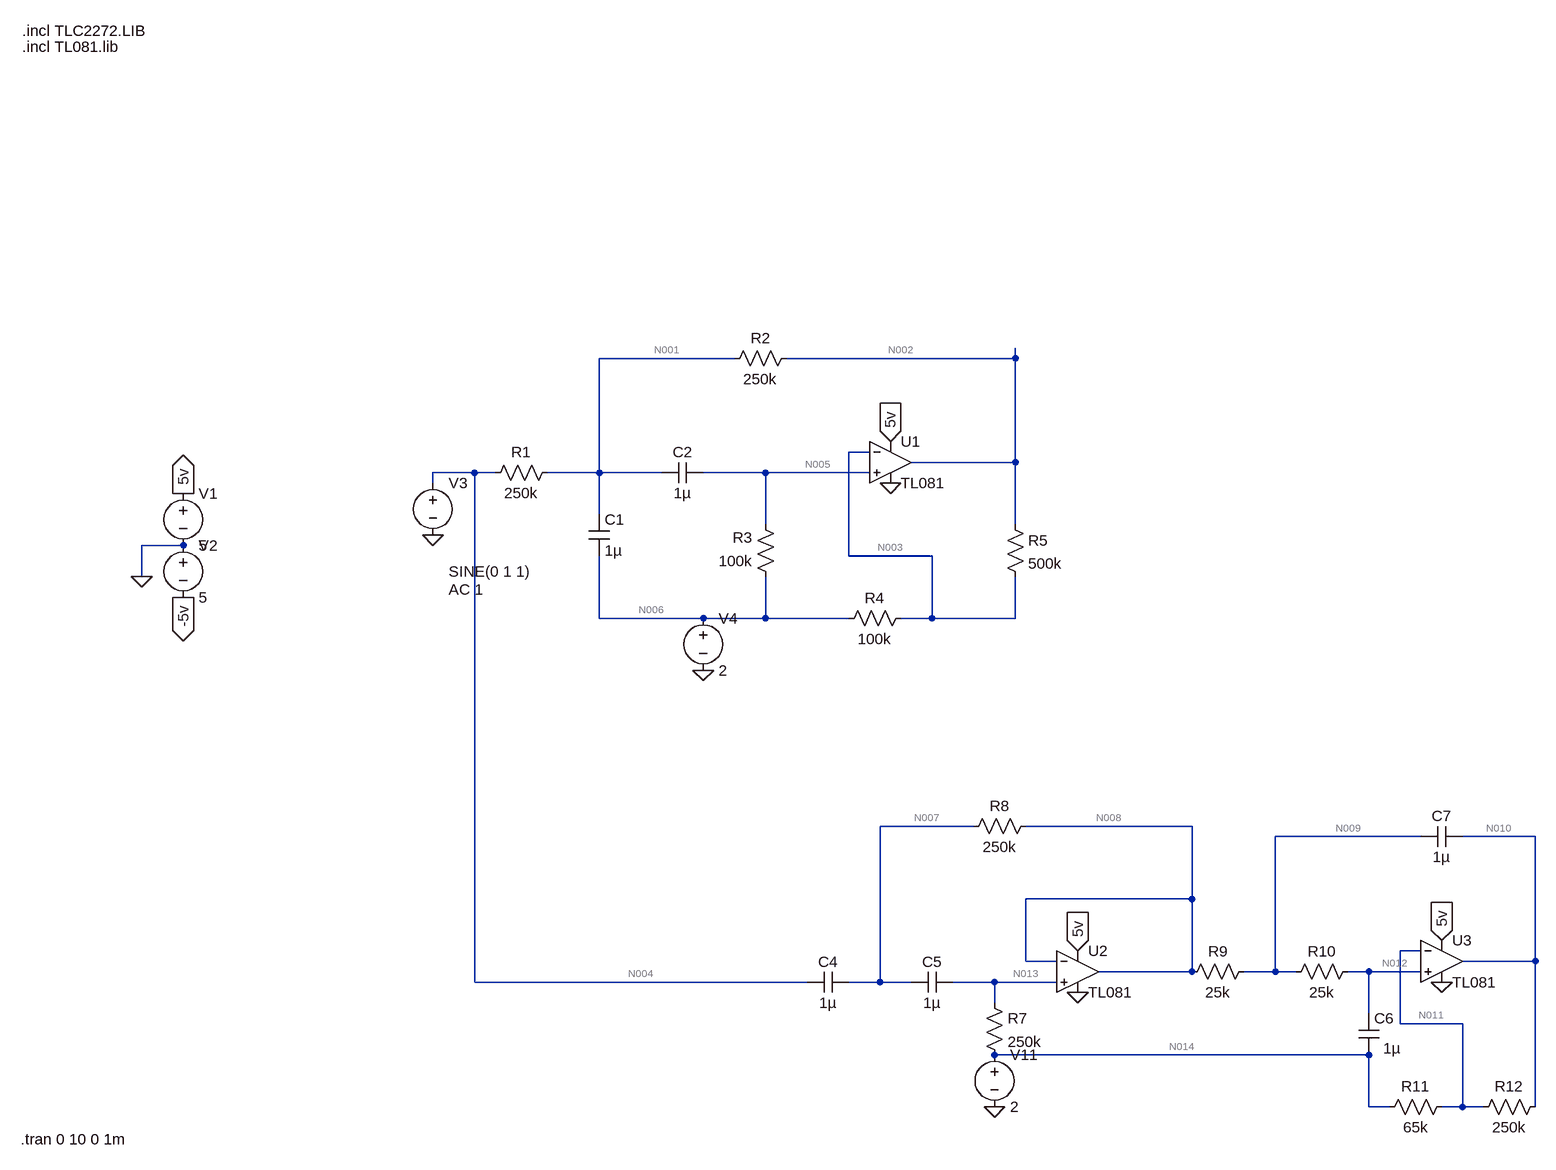
[diagram p0: schematic test2.asc]
test2.asc, the LTspice schematic file:
Version 4
SHEET 1 2552 2084
WIRE 784 -144 576 -144
WIRE 1216 -144 1216 -160
WIRE 1216 -144 864 -144
WIRE 992 0 960 0
WIRE 1216 16 1216 -144
WIRE 1216 16 1056 16
WIRE 384 32 320 32
WIRE 416 32 384 32
WIRE 576 32 576 -144
WIRE 576 32 496 32
WIRE 672 32 576 32
WIRE 832 32 736 32
WIRE 992 32 832 32
WIRE 320 48 320 32
WIRE 576 96 576 32
WIRE 832 112 832 32
WIRE 1216 112 1216 16
WIRE -64 144 -128 144
WIRE 960 160 960 0
WIRE 1088 160 960 160
WIRE -128 192 -128 144
WIRE 576 256 576 160
WIRE 736 256 576 256
WIRE 832 256 832 192
WIRE 832 256 736 256
WIRE 960 256 832 256
WIRE 1088 256 1088 160
WIRE 1088 256 1040 256
WIRE 1216 256 1216 192
WIRE 1216 256 1088 256
WIRE 1152 576 1008 576
WIRE 1488 576 1232 576
WIRE 1840 592 1616 592
WIRE 2016 592 1904 592
WIRE 1488 688 1488 576
WIRE 1488 688 1232 688
WIRE 1840 768 1808 768
WIRE 1232 784 1232 688
WIRE 1280 784 1232 784
WIRE 2016 784 2016 592
WIRE 2016 784 1904 784
WIRE 1488 800 1488 688
WIRE 1488 800 1344 800
WIRE 1616 800 1616 592
WIRE 1616 800 1568 800
WIRE 1648 800 1616 800
WIRE 1760 800 1728 800
WIRE 1840 800 1760 800
WIRE 384 816 384 32
WIRE 896 816 384 816
WIRE 1008 816 1008 576
WIRE 1008 816 960 816
WIRE 1056 816 1008 816
WIRE 1184 816 1120 816
WIRE 1280 816 1184 816
WIRE 1184 848 1184 816
WIRE 1760 864 1760 800
WIRE 1808 880 1808 768
WIRE 1904 880 1808 880
WIRE 1760 928 1184 928
WIRE 1760 1008 1760 928
WIRE 1792 1008 1760 1008
WIRE 1904 1008 1904 880
WIRE 1904 1008 1872 1008
WIRE 1936 1008 1904 1008
WIRE 2016 1008 2016 784
FLAG -64 224 -5v
IOPIN -64 224 Out
FLAG -64 64 5v
IOPIN -64 64 Out
FLAG -128 192 0
FLAG 1024 -16 5v
IOPIN 1024 -16 In
FLAG 320 128 0
FLAG 736 336 0
FLAG 1024 48 0
FLAG 1184 1008 0
FLAG 1312 768 5v
IOPIN 1312 768 In
FLAG 1312 832 0
FLAG 1872 752 5v
IOPIN 1872 752 In
FLAG 1872 816 0
SYMBOL voltage -64 48 R0
WINDOW 123 0 0 Left 0
WINDOW 39 0 0 Left 0
SYMATTR InstName V1
SYMATTR Value 5
SYMBOL voltage -64 128 R0
WINDOW 123 0 0 Left 0
WINDOW 39 0 0 Left 0
SYMATTR InstName V2
SYMATTR Value 5
SYMBOL res 512 16 R90
WINDOW 0 0 56 VBottom 2
WINDOW 3 32 56 VTop 2
SYMATTR InstName R1
SYMATTR Value 250k
SYMBOL res 880 -160 R90
WINDOW 0 0 56 VBottom 2
WINDOW 3 32 56 VTop 2
SYMATTR InstName R2
SYMATTR Value 250k
SYMBOL res 848 208 R180
WINDOW 0 36 76 Left 2
WINDOW 3 36 40 Left 2
SYMATTR InstName R3
SYMATTR Value 100k
SYMBOL res 944 272 R270
WINDOW 0 32 56 VTop 2
WINDOW 3 0 56 VBottom 2
SYMATTR InstName R4
SYMATTR Value 100k
SYMBOL Opamps\\opamp2 1024 -48 R0
SYMATTR InstName U1
SYMATTR Value TL081
SYMBOL cap 560 96 R0
SYMATTR InstName C1
SYMATTR Value 1µ
SYMBOL cap 736 16 R90
WINDOW 0 0 32 VBottom 2
WINDOW 3 32 32 VTop 2
SYMATTR InstName C2
SYMATTR Value 1µ
SYMBOL voltage 320 32 R0
WINDOW 3 24 152 Left 2
WINDOW 123 24 180 Left 2
WINDOW 39 0 0 Left 0
SYMATTR InstName V3
SYMATTR Value SINE(0 1 1)
SYMATTR Value2 AC 1
SYMBOL res 1200 96 R0
SYMATTR InstName R5
SYMATTR Value 500k
SYMBOL voltage 736 240 R0
WINDOW 123 0 0 Left 0
WINDOW 39 0 0 Left 0
SYMATTR InstName V4
SYMATTR Value 2
SYMBOL Opamps\\opamp2 1312 736 R0
SYMATTR InstName U2
SYMATTR Value TL081
SYMBOL cap 960 800 R90
WINDOW 0 0 32 VBottom 2
WINDOW 3 32 32 VTop 2
SYMATTR InstName C4
SYMATTR Value 1µ
SYMBOL cap 1120 800 R90
WINDOW 0 0 32 VBottom 2
WINDOW 3 32 32 VTop 2
SYMATTR InstName C5
SYMATTR Value 1µ
SYMBOL res 1168 832 R0
SYMATTR InstName R7
SYMATTR Value 250k
SYMBOL voltage 1184 912 R0
WINDOW 123 0 0 Left 0
WINDOW 39 0 0 Left 0
SYMATTR InstName V11
SYMATTR Value 2
SYMBOL res 1248 560 R90
WINDOW 0 0 56 VBottom 2
WINDOW 3 32 56 VTop 2
SYMATTR InstName R8
SYMATTR Value 250k
SYMBOL res 1584 784 R90
WINDOW 0 0 56 VBottom 2
WINDOW 3 32 56 VTop 2
SYMATTR InstName R9
SYMATTR Value 25k
SYMBOL res 1744 784 R90
WINDOW 0 0 56 VBottom 2
WINDOW 3 32 56 VTop 2
SYMATTR InstName R10
SYMATTR Value 25k
SYMBOL Opamps\\opamp2 1872 720 R0
SYMATTR InstName U3
SYMATTR Value TL081
SYMBOL cap 1744 864 R0
WINDOW 3 38 54 Left 2
SYMATTR InstName C6
SYMATTR Value 1µ
SYMBOL res 1888 992 R90
WINDOW 0 0 56 VBottom 2
WINDOW 3 32 56 VTop 2
SYMATTR InstName R11
SYMATTR Value 65k
SYMBOL res 2032 992 R90
WINDOW 0 0 56 VBottom 2
WINDOW 3 32 56 VTop 2
SYMATTR InstName R12
SYMATTR Value 250k
SYMBOL cap 1904 576 R90
WINDOW 0 0 32 VBottom 2
WINDOW 3 32 32 VTop 2
SYMATTR InstName C7
SYMATTR Value 1µ
TEXT -312 -648 Left 2 !.incl TLC2272.LIB
TEXT -312 -624 Left 2 !.incl TL081.lib
TEXT -314 1058 Left 2 !.tran 0 10 0 1m

The netlist it stands for:
* test2.asc
V1 5v 0 5
V2 0 -5v 5
R1 N001 N004 250k
R2 N002 N001 250k
R3 N006 N005 100k
R4 N006 N003 100k
XU1 N005 N003 5v 0 N002 TL081  ; pins In+ In- V+ V- OUT
C1 N001 N006 1µ
C2 N005 N001 1µ
V3 N004 0 SINE(0 1 1) AC 1
R5 N002 N003 500k
V4 N006 0 2
XU2 N013 N008 5v 0 N008 TL081  ; pins In+ In- V+ V- OUT
C4 N007 N004 1µ
C5 N013 N007 1µ
R7 N013 N014 250k
V11 N014 0 2
R8 N008 N007 250k
R9 N009 N008 25k
R10 N012 N009 25k
XU3 N012 N011 5v 0 N010 TL081  ; pins In+ In- V+ V- OUT
C6 N012 N014 1µ
R11 N011 N014 65k
R12 N010 N011 250k
C7 N010 N009 1µ
.incl TLC2272.LIB
.incl TL081.lib
.tran 0 10 0 1m
.backanno
.end

* Results of the author's LTspice run, read from the files saved beside the schematic
* Operating Point, zero values left out:
*   V(5v) = 5 V
*   V(-5v) = -5 V
*   V(n001) = 1 V
*   V(n002) = 2 V
*   V(n006) = 2 V
*   V(n005) = 2 V
*   V(n003) = 2 V
*   V(n008) = 2 V
*   V(n013) = 2 V
*   V(n007) = 2 V
*   V(n014) = 2 V
*   V(n009) = 2 V
*   V(n012) = 2 V
*   V(n010) = 2 V
*   V(n011) = 2 V
*   I(R12) = 710.7 pA
*   I(R11) = 678.6 pA
*   I(R10) = -32.05 pA
*   I(R9) = -32.05 pA
*   I(R7) = -32.05 pA
*   I(R5) = 268.6 pA
*   I(R4) = -236.5 pA
*   I(R3) = 32.05 pA
*   I(R2) = 4 µA
*   I(R1) = 4 µA
*   I(V11) = 646.6 pA
*   I(V4) = 204.5 pA
*   I(V3) = 4 µA
*   I(V1) = -7.585 mA
*   Ix(u1:1) = 32.05 pA
*   Ix(u1:2) = 32.05 pA
*   Ix(u1:3) = 2.528 mA
*   Ix(u1:4) = -2.529 mA
*   Ix(u1:5) = -4.001 µA
*   Ix(u2:1) = 32.05 pA
*   Ix(u2:2) = 32.05 pA
*   Ix(u2:3) = 2.528 mA
*   Ix(u2:4) = -2.529 mA
*   Ix(u2:5) = -64.1 pA
*   Ix(u3:1) = 32.05 pA
*   Ix(u3:2) = 32.05 pA
*   Ix(u3:3) = 2.528 mA
*   Ix(u3:4) = -2.529 mA
*   Ix(u3:5) = -710.7 pA
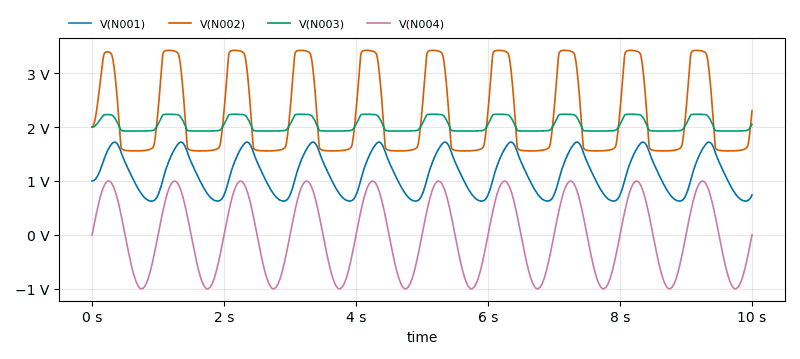
[diagram p1: Transient Analysis of test2.asc, plotted from the saved traces]
* Transient Analysis, 1 run:
*   V(N001): min 626.9 mV, max 1.721 V, average 1.132 V, rms 1.193 V, last 742.2 mV
*   V(N002): min 1.557 V, max 3.422 V, average 2.25 V, rms 2.385 V, last 2.304 V
*   V(N003): min 1.926 V, max 2.237 V, average 2.042 V, rms 2.046 V, last 2.051 V
*   V(N004): min -999.7 mV, max 1 V, average -11.35 µV, rms 706.8 mV, last 0 V